# EAGLE design emat_pwr (EAGLE 7.5.0)

## Sheet 1 of 2
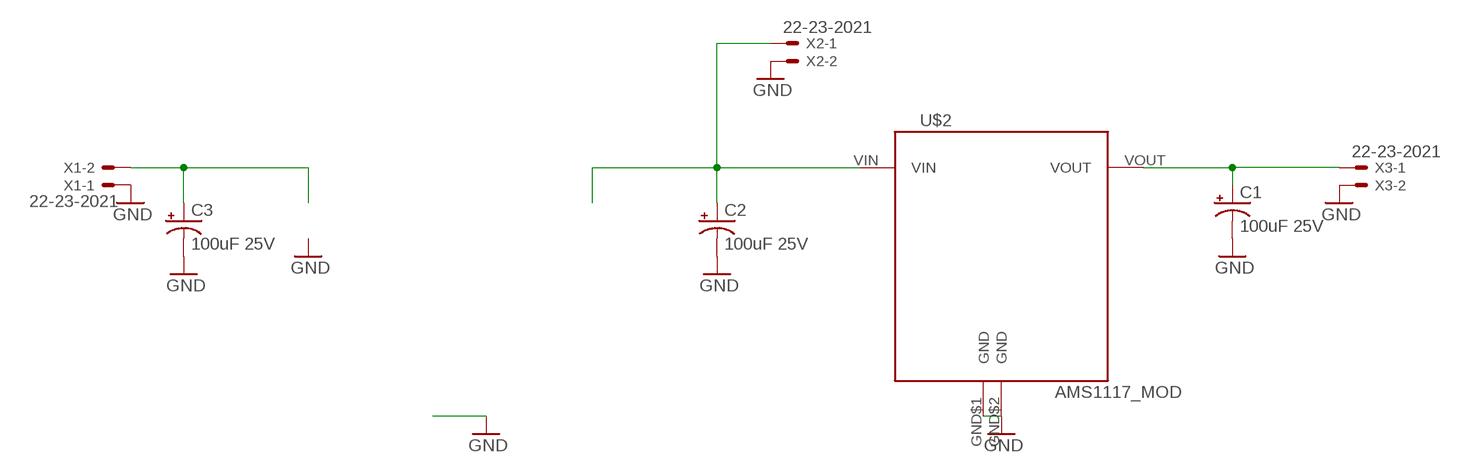
[diagram p0: schematic, sheet 1]

### Parts
C1  100uF 25V  100UF-25V-20%(PTH)  [CPOL-RADIAL-100UF-25V]
C2  100uF 25V  100UF-25V-20%(PTH)  [CPOL-RADIAL-100UF-25V]
C3  100uF 25V  100UF-25V-20%(PTH)  [CPOL-RADIAL-100UF-25V]
U$2  AMS1117_MOD  [AMS1117_MOD]
X1  22-23-2021  [22-23-2021]
X2  22-23-2021  [22-23-2021]
X3  22-23-2021  [22-23-2021]

### Nets
GND: C1.2(-) C2.2(-) C3.2(-) U$2.GND$1(GND) X1.1 X2.2 X3.2 ; also sheet 2
N$1: C2.1(+) U$2.VIN X2.1
N$2: C1.1(+) U$2.VOUT X3.1
N$3: C3.1(+) X1.2

## Sheet 2 of 2
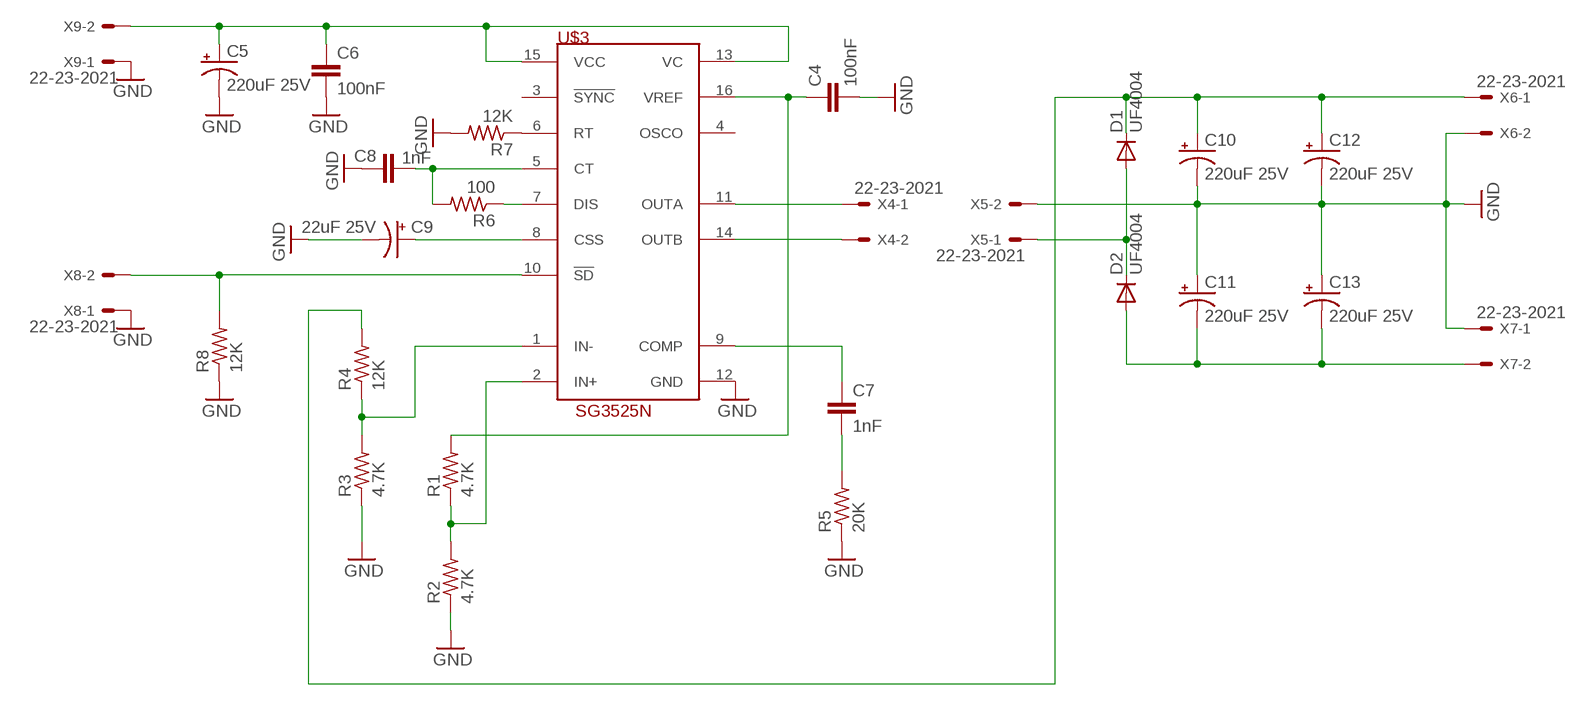
[diagram p1: schematic, sheet 2]

### Parts
C4  100nF  C-EUC0805  [C0805]
C5  220uF 25V  CPOL-USE5-8.5  [E5-8,5]
C6  100nF  C-EUC0805  [C0805]
C7  1nF  C-EUC0805  [C0805]
C8  1nF  C-EUC0805  [C0805]
C9  22uF 25V  CPOL-USE5-8.5  [E5-8,5]
C10  220uF 25V  CPOL-USE5-8.5  [E5-8,5]
C11  220uF 25V  CPOL-USE5-8.5  [E5-8,5]
C12  220uF 25V  CPOL-USE5-8.5  [E5-8,5]
C13  220uF 25V  CPOL-USE5-8.5  [E5-8,5]
D1  UF4004  DIODE-DO41-7.6  [DO41-7.6]
D2  UF4004  DIODE-DO41-7.6  [DO41-7.6]
R1  4.7K  R-US_R1206  [R1206]
R2  4.7K  R-US_R1206  [R1206]
R3  4.7K  R-US_R1206  [R1206]
R4  12K  R-US_R1206  [R1206]
R5  20K  R-US_R1206  [R1206]
R6  100  R-US_R1206  [R1206]
R7  12K  R-US_R1206  [R1206]
R8  12K  R-US_R1206  [R1206]
U$3  SG3525N  [DIL16]
X4  22-23-2021  [22-23-2021]
X5  22-23-2021  [22-23-2021]
X6  22-23-2021  [22-23-2021]
X7  22-23-2021  [22-23-2021]
X8  22-23-2021  [22-23-2021]
X9  22-23-2021  [22-23-2021]

### Nets
COMP: C7.1 U$3.9(COMP)
CSS: C9.+ U$3.8(CSS)
GND: C4.2 C5.- C6.2 C8.1 C9.- C10.- C11.+ C12.- C13.+ R2.1 R3.1 R5.1 R7.2 R8.1 U$3.12(GND) X5.2 X6.2 X7.1 X8.1 X9.1 ; also sheet 1
IN-: R3.2 R4.1 U$3.1(IN-)
N$5: R1.1 R2.2 U$3.2(IN+)
N$6: C7.2 R5.2
N$7: R6.1 U$3.7(DIS)
N$8: C8.2 R6.2 U$3.5(CT)
N$9: R7.1 U$3.6(RT)
N$10: D1.A D2.C X5.1
N$11: C10.+ C12.+ D1.C R4.2 X6.1
N$12: C11.- C13.- D2.A X7.2
N$13: R8.2 U$3.10(!SD) X8.2
OUTA: U$3.11(OUTA) X4.1
OUTB: U$3.14(OUTB) X4.2
VCC: C5.+ C6.1 U$3.13(VC) U$3.15(VCC) X9.2
VREF: C4.1 R1.2 U$3.16(VREF)
Unconnected: U$3.3(!SYNC) U$3.4(OSCO)

## Power pins joined to a net without a drawn wire
GND: U$2.GND$2(GND)

## Library data of the parts
C1-C3 = SparkFun-Capacitors:100UF-25V-20%(PTH): CAP-08439; PROD_ID: CAP-08439
C4 C6-C8 = resistor:C-EU: CAPACITOR, European symbol
C5 C9-C13 = rcl:CPOL-US: POLARIZED CAPACITOR, American symbol
D1 D2 = diode:DIODE-: DIODE
R1-R8 = resistor:R-US_: RESISTOR, American symbol
U$2 = GeekAmmo:AMS1117_MOD
U$3 = irs:SG3525
X1-X9 = con-molex:22-23-2021: .100" (2.54mm) Center Header - 2 Pin; MF: MOLEX; MPN: 22-23-2021; OC_FARNELL: 1462926; OC_NEWARK: 25C3832

## Board
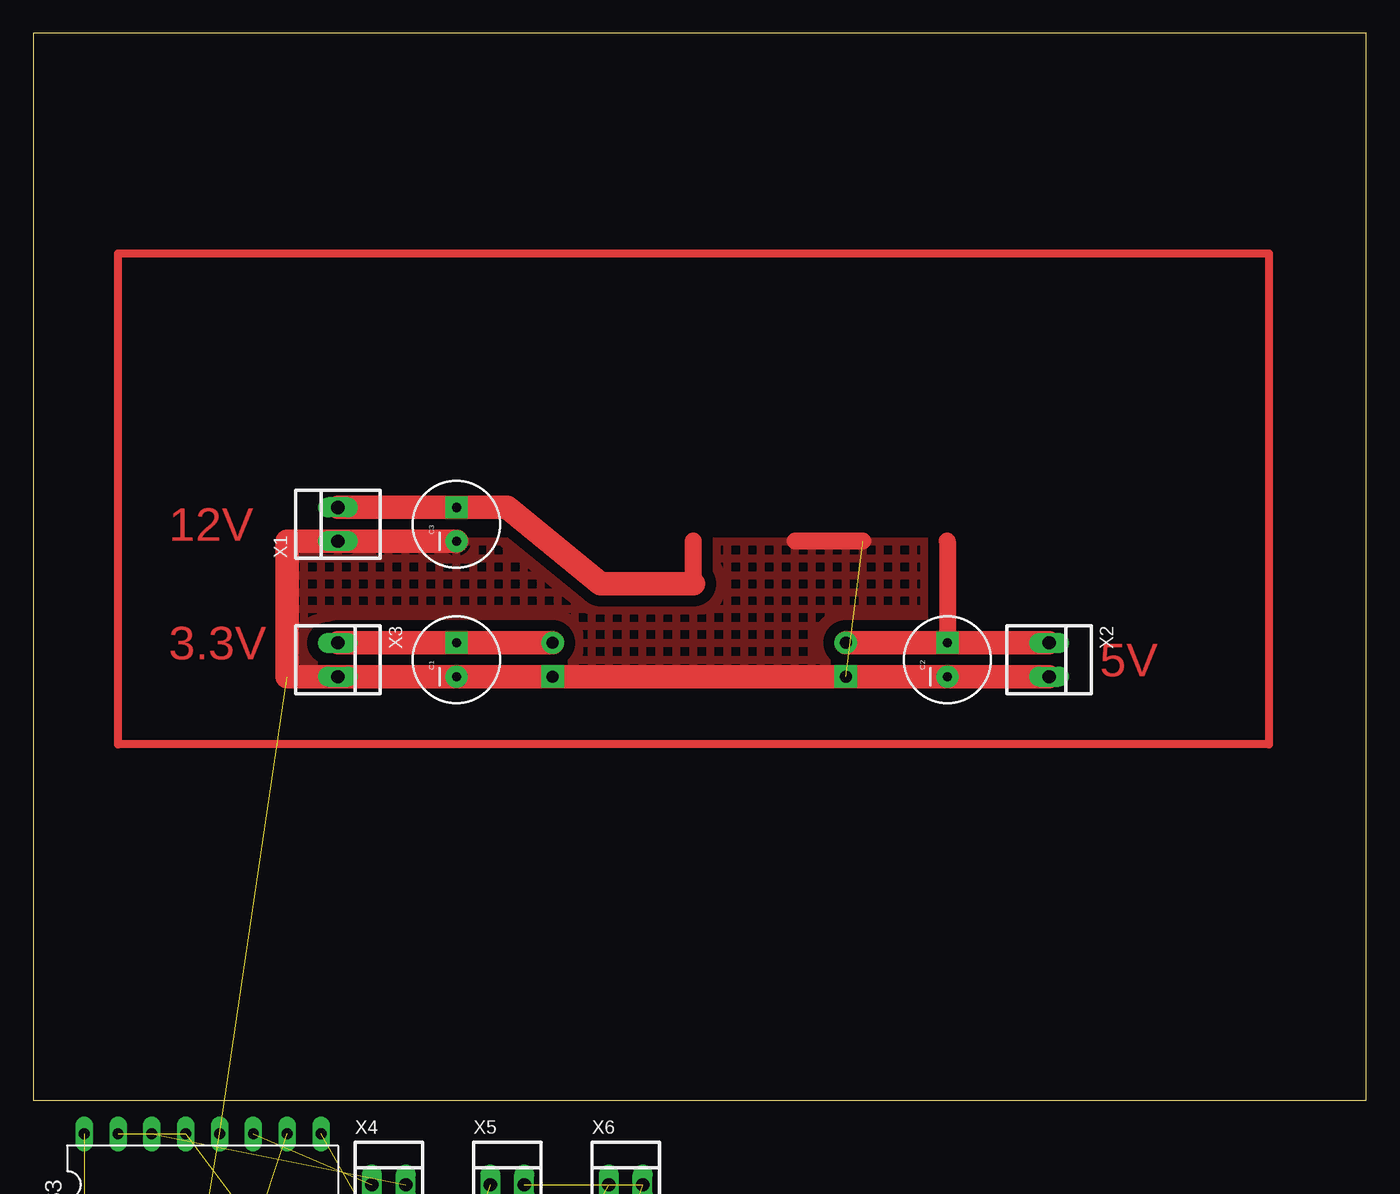
[diagram p2: board, top side]
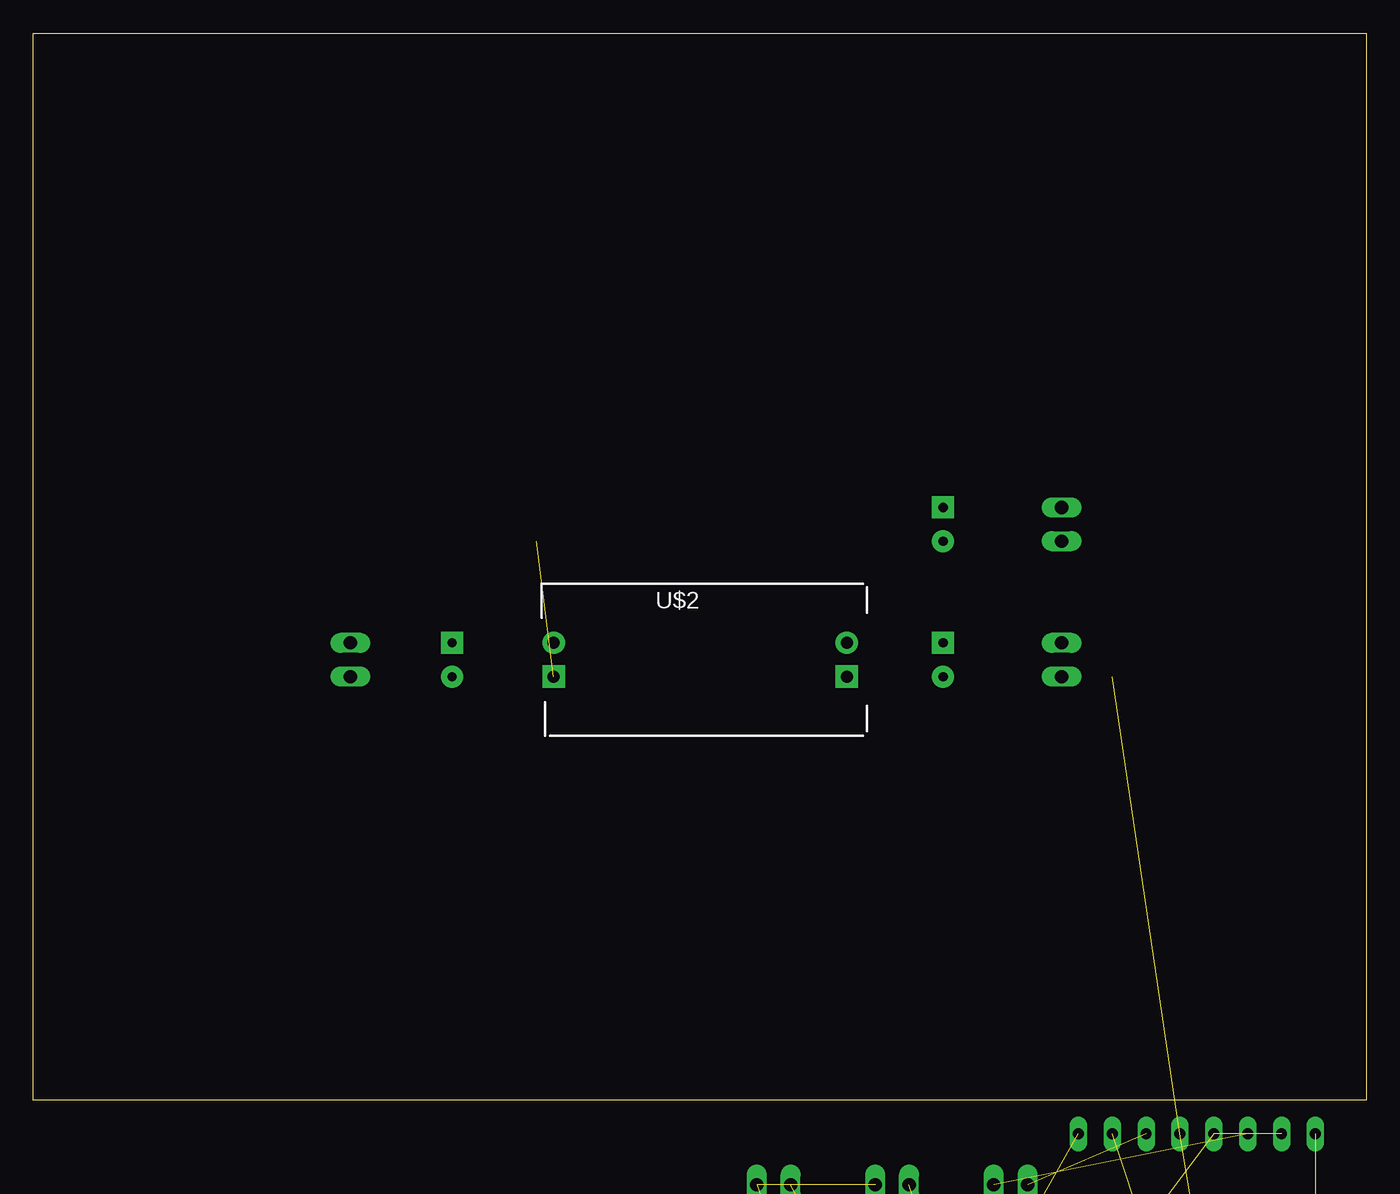
[diagram p3: board, bottom side, seen from below]

Size 100 x 80 mm. Coordinates in mm from the lower left corner, seen from the top.
Outline: 0,0 100,0 100,80 0,80 0,0
Copper layers (1*16): Top 0.035mm / dielectric 1.5mm / Bottom 0.035mm
Design rules "default": minimum track width 10mil, minimum drill 24mil, track to track 8mil, track to pad 8mil, pad to pad 8mil, via to via 8mil, smd to smd 8mil, copper to edge 40mil, drill to drill 8mil, minimum pad ring 10mil, minimum via ring 8mil, stop-mask expansion 4mil, vias tented up to drill 0mil, thermal gap 10mil

### Footprints (pad centres in the part's own frame; a part is rotated, then mirrored left to right if it is on the bottom)
CPOL-RADIAL-100UF-25V = drill 0.7 pad 1.651 square: 1 1.27,0 | drill 0.7 pad 1.651: 2 -1.27,0
C0805 = smd 1.3 x 1.5: 1 -0.95,0; 2 0.95,0
E5-8,5 = drill 1.016 pad 2.54: + -2.54,0 | drill 1.016 pad 2.54 octagon: - 2.54,0
DO41-7.6 = drill 1.1 pad 1.7: A 3.81,0; C -3.81,0
R1206 = smd 1.6 x 1.803: 1 -1.422,0; 2 1.422,0
AMS1117_MOD = drill 0.9 pad 1.676 square: GND$1 0,-2.54; GND$2 21.996,-2.54 | drill 0.9 pad 1.676: VIN 0,0; VOUT 21.996,0
DIL16 = drill 0.813 long: 1 -8.89,-3.81; 2 -6.35,-3.81; 3 -3.81,-3.81; 4 -1.27,-3.81; 5 1.27,-3.81; 6 3.81,-3.81; 7 6.35,-3.81; 8 8.89,-3.81; 9 8.89,3.81; 10 6.35,3.81; 11 3.81,3.81; 12 1.27,3.81; 13 -1.27,3.81; 14 -3.81,3.81; 15 -6.35,3.81; 16 -8.89,3.81
22-23-2021 = drill 1 long: 1 -1.27,0; 2 1.27,0

### Placement (x,y rotation side)
C1  31.75,33.02 90 top
C2  68.58,33.02 90 top
C3  31.75,43.18 90 top
C4  35.56,-35.56 0 top  (outside the outline)
C5  43.18,-27.94 0 top  (outside the outline)
C6  43.18,-35.56 0 top  (outside the outline)
C7  46.99,-45.72 0 top  (outside the outline)
C8  2.54,-52.07 0 top  (outside the outline)
C9  5.08,-38.1 0 top  (outside the outline)
C10  39.37,-17.78 0 top  (outside the outline)
C11  5.08,-27.94 0 top  (outside the outline)
C12  17.78,-27.94 0 top  (outside the outline)
C13  30.48,-27.94 0 top  (outside the outline)
D1  17.78,-36.83 0 top  (outside the outline)
D2  27.94,-36.83 0 top  (outside the outline)
R1  2.54,-45.72 0 top  (outside the outline)
R2  8.89,-45.72 0 top  (outside the outline)
R3  15.24,-45.72 0 top  (outside the outline)
R4  21.59,-45.72 0 top  (outside the outline)
R5  26.67,-45.72 0 top  (outside the outline)
R6  31.75,-45.72 0 top  (outside the outline)
R7  36.83,-45.72 0 top  (outside the outline)
R8  41.91,-45.72 0 top  (outside the outline)
U$2  60.96,34.29 0 bottom
U$3  12.7,-6.35 0 top
X1  22.86,43.18 90 top
X2  76.2,33.02 270 top
X3  22.86,33.02 270 top
X4  26.67,-6.35 0 top  (outside the outline)
X5  35.56,-6.35 0 top  (outside the outline)
X6  44.45,-6.35 0 top  (outside the outline)
X7  3.81,-17.78 0 top  (outside the outline)
X8  12.7,-17.78 0 top  (outside the outline)
X9  21.59,-17.78 0 top  (outside the outline)

### Tracks (layer width: path | path; a pad name or v marks a point on that pad's centre or on a via)
COMP  (1 unrouted)
CSS  (1 unrouted)
GND  (21 unrouted)
  Top 1.27: 62.23,41.91 59.69,41.91 57.15,41.91
  Top 1.778: X2.2 C2.2 U$2.GND$1 54.61,31.75 U$2.GND$2 C1.2 X3.2 19.05,31.75 19.05,41.91 C3.2 X1.1
  pour Top (isolate 0.813, hatched): 19.05,41.91 38.1,41.91 38.1,43.18 41.91,39.37 49.53,39.37 49.53,41.91 68.58,41.91 68.58,31.75 19.05,31.75
IN-  (2 unrouted)
N$1
  Top 1.27: 68.58,41.91 C2.1
  Top 1.778: X2.1 C2.1 U$2.VIN
N$2
  Top 1.778: U$2.VOUT C1.1 X3.1
N$3
  Top 1.27: 49.53,38.73 49.53,41.91
  Top 1.778: 49.53,38.73 42.55,38.73 35.56,44.45 C3.1 X1.2
N$4
  Top 0.61: 6.35,26.67 6.35,63.5 92.71,63.5 92.71,26.67 6.35,26.67
N$5  (2 unrouted)
N$6  (1 unrouted)
N$7  (1 unrouted)
N$8  (2 unrouted)
N$9  (1 unrouted)
N$10  (2 unrouted)
N$11  (4 unrouted)
N$12  (3 unrouted)
N$13  (2 unrouted)
OUTA  (1 unrouted)
OUTB  (1 unrouted)
VCC  (4 unrouted)
VREF  (2 unrouted)

### Text on the board
Top: 12V | 3.3V | 5V